# Altium schematic sheet 09_MRAM_RTC_WDT.SchDoc
size 420 x 297 mm; SheetNumber: 17; SheetTotal: 24
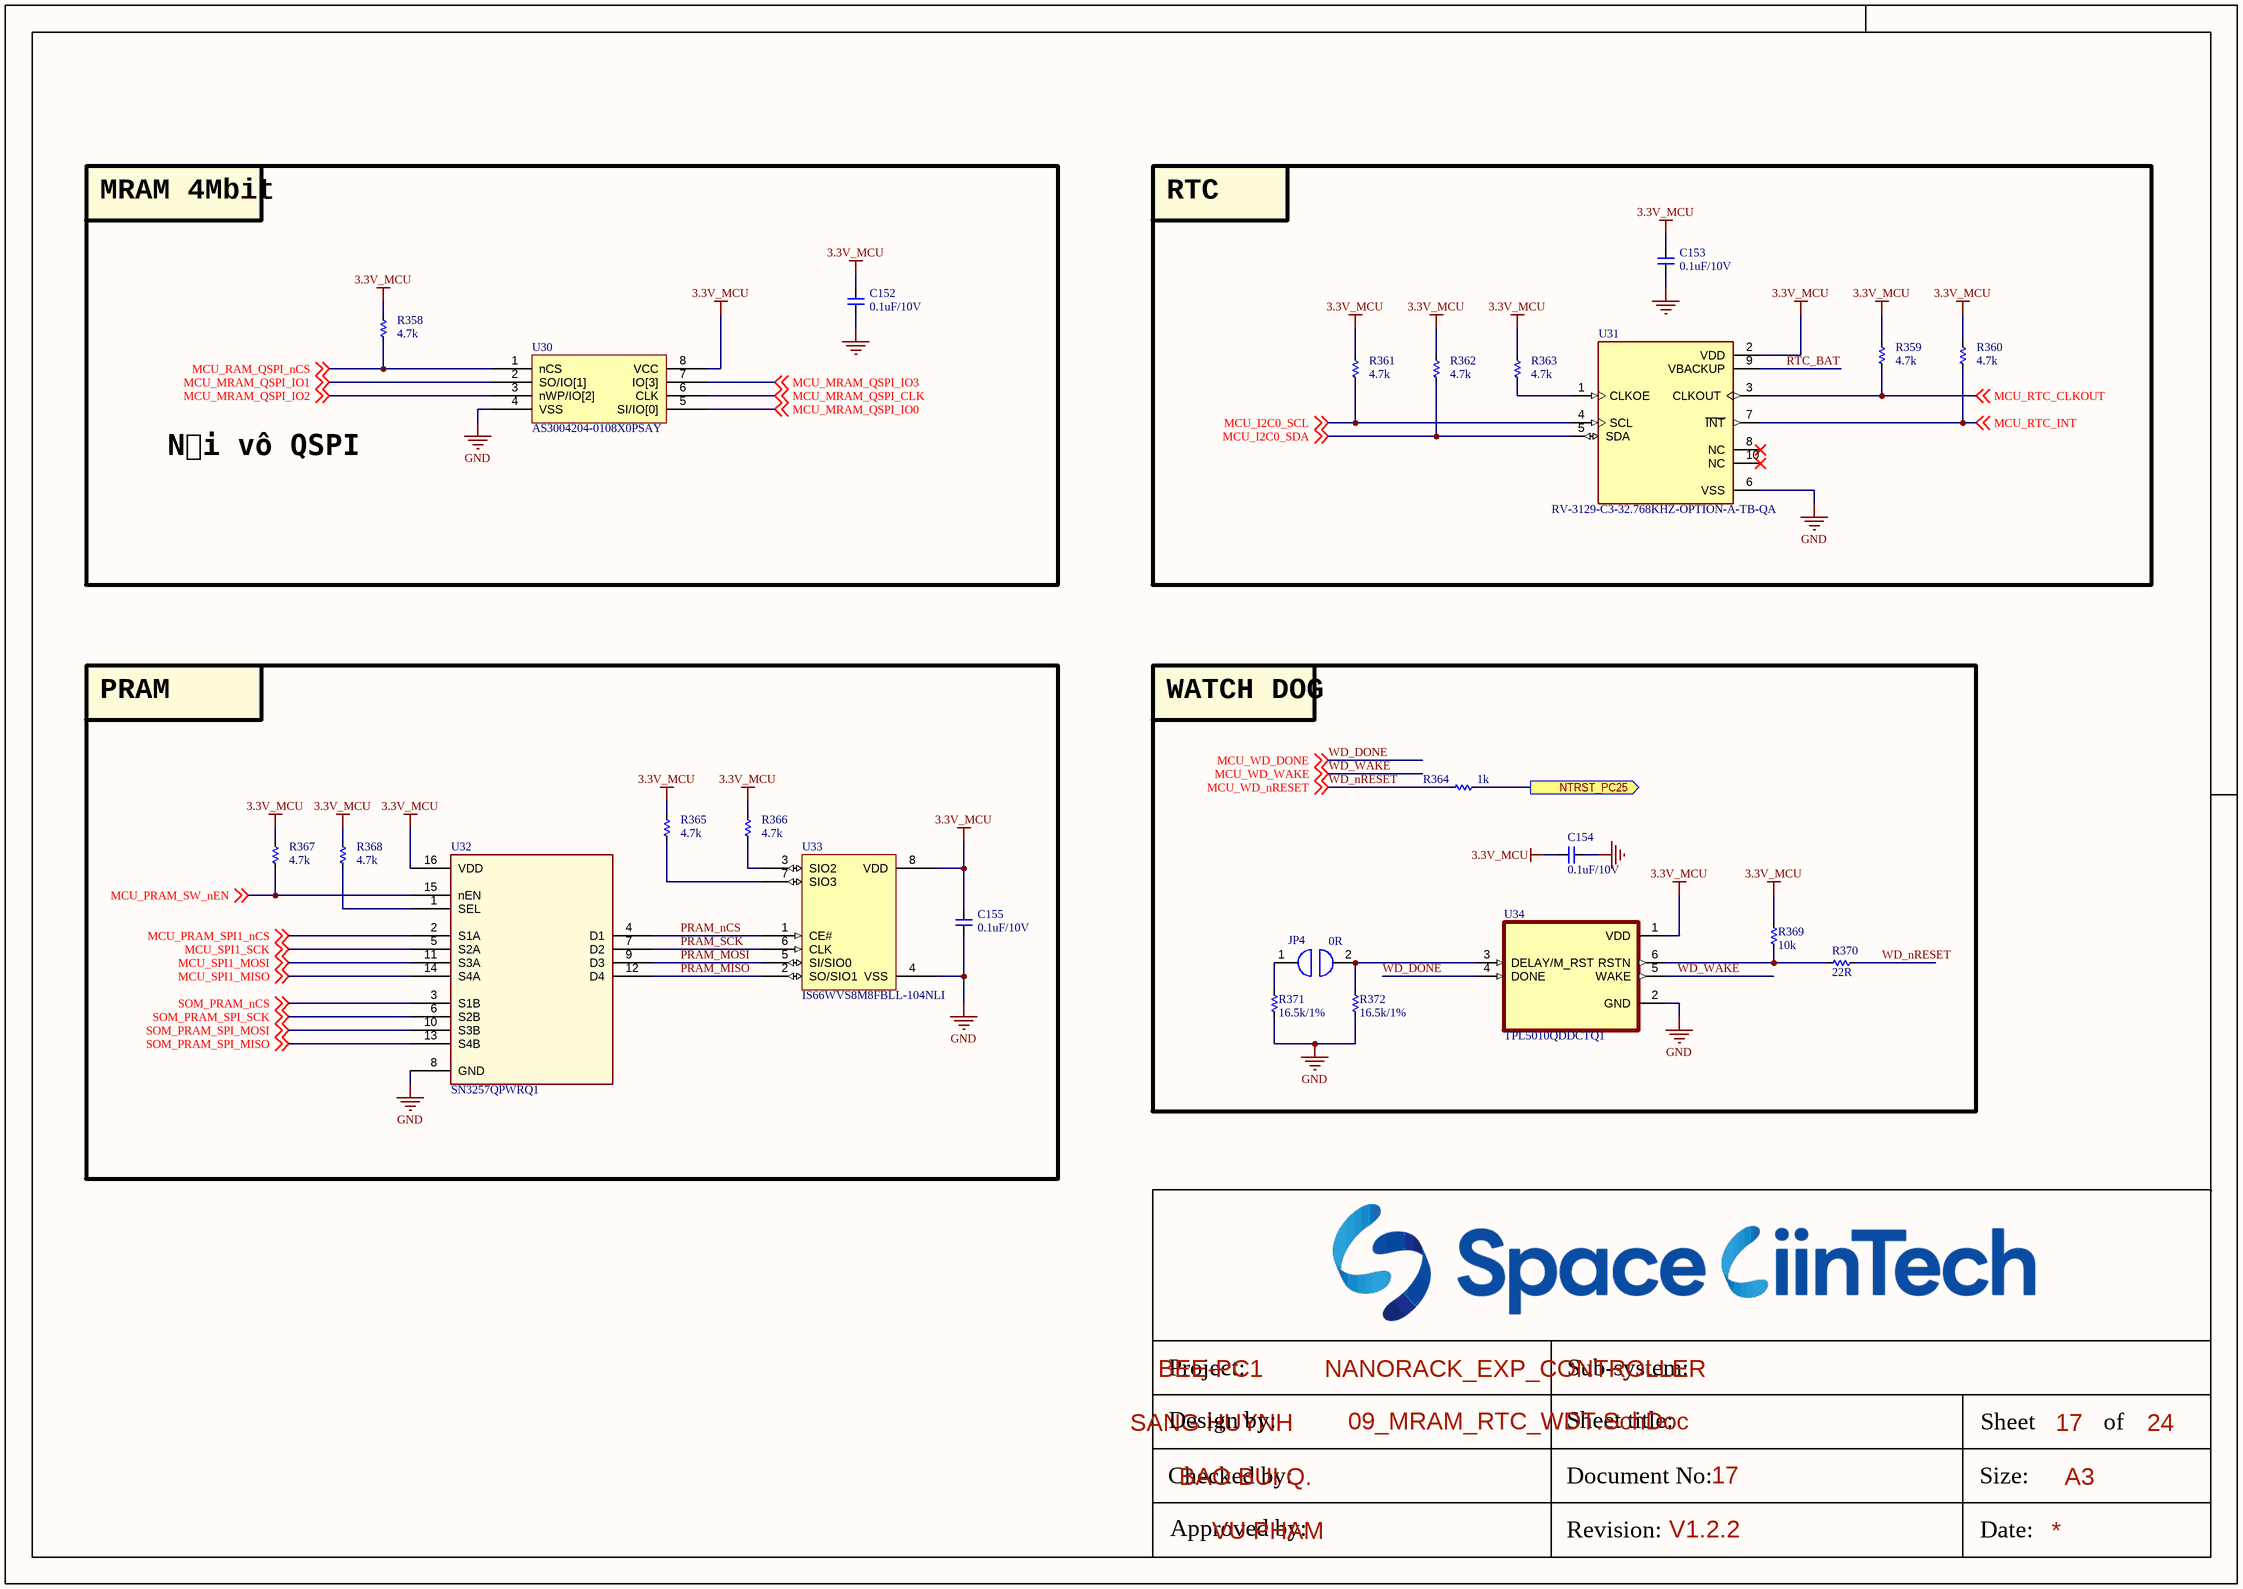
[diagram p0: 09_MRAM_RTC_WDT.SchDoc]

## Parts
C152  0.1uF/10V  [CAP_C_1005X60]
C153  0.1uF/10V  [CAP_C_1005X60]
C154  0.1uF/10V  [CAP_C_1005X60]
C155  0.1uF/10V  [CAP_C_1005X60]
JP4  0R  [RES_C_1608X60]
R358  4.7k  [RES_C_1005X40]
R359  4.7k  [RES_C_1005X40]
R360  4.7k  [RES_C_1005X40]
R361  4.7k  [RES_C_1005X40]
R362  4.7k  [RES_C_1005X40]
R363  4.7k  [RES_C_1005X40]
R364  1k  [RES_C_1005X40]
R365  4.7k  [RES_C_1005X40]
R366  4.7k  [RES_C_1005X40]
R367  4.7k  [RES_C_1005X40]
R368  4.7k  [RES_C_1005X40]
R369  10k  [RES_C_1005X40]
R370  22R  [RES_C_1005X40]
R371  16.5k/1%  [RES_C_1005X40]
R372  16.5k/1%  [RES_C_1005X40]
U30  AS3004204-0108X0PSAY  [SOIC127P790X216-8]
U31  RV-3129-C3-32.768KHZ-OPTION-A-TB-QA  [IC_RV-3129-C3_32.768KHZ_OPTION_A_TB_QA]
U32  SN3257QPWRQ1  [SOIC_PRQ1_TEX]
U33  IS66WVS8M8FBLL-104NLI  [SOIC8_150MIL_N_ISI]
U34  TPL5010QDDCTQ1  [SOT95P280X145-6N]

## Blocks framed on the sheet
RTC: C153 R359-R363 U31
PRAM: C155 R365-R368 U32 U33
WATCH DOG: C154 JP4 R364 R369-R372 U34

## Ports
NTRST_PC25 (out)

## Nets
3.3V_MCU: C152.2 C153.2 C154.2 C155.1 R358.2 R359.2 R360.2 R361.2 R362.2 R363.1 R365.2 R366.2 R367.2 R368.2 R369.2 U30.8(VCC) U31.2(VDD) U32.16(VDD) U33.8(VDD) U34.1(VDD)
GND: C152.1 C153.1 C154.1 C155.2 R371.1 R372.1 U30.4(VSS) U31.6(VSS) U32.8(GND) U33.4(VSS) U34.2(GND)
MCU_I2C0_SCL: R361.1 U31.4(SCL) ; off-sheet MCU_I2C0_SCL
MCU_I2C0_SDA: R362.1 U31.5(SDA) ; off-sheet MCU_I2C0_SDA
MCU_MRAM_QSPI_CLK: U30.6(CLK) ; off-sheet MCU_MRAM_QSPI_CLK
MCU_MRAM_QSPI_IO0: U30.5(SI/IO[0]) ; off-sheet MCU_MRAM_QSPI_IO0
MCU_MRAM_QSPI_IO1: U30.2(SO/IO[1]) ; off-sheet MCU_MRAM_QSPI_IO1
MCU_MRAM_QSPI_IO2: U30.3(nWP/IO[2]) ; off-sheet MCU_MRAM_QSPI_IO2
MCU_MRAM_QSPI_IO3: U30.7(IO[3]) ; off-sheet MCU_MRAM_QSPI_IO3
MCU_PRAM_SPI1_nCS: U32.2(S1A) ; off-sheet MCU_PRAM_SPI1_nCS
MCU_PRAM_SW_nEN: R367.1 U32.15(nEN) ; off-sheet MCU_PRAM_SW_nEN
MCU_RAM_QSPI_nCS: R358.1 U30.1(nCS) ; off-sheet MCU_RAM_QSPI_nCS
MCU_RTC_CLKOUT: R359.1 U31.3(CLKOUT) ; off-sheet MCU_RTC_CLKOUT
MCU_RTC_INT: R360.1 U31.7(~{INT}) ; off-sheet MCU_RTC_INT
MCU_SPI1_MISO: U32.14(S4A) ; off-sheet MCU_SPI1_MISO
MCU_SPI1_MOSI: U32.11(S3A) ; off-sheet MCU_SPI1_MOSI
MCU_SPI1_SCK: U32.5(S2A) ; off-sheet MCU_SPI1_SCK
NTRST_PC25: R364.1 ; port NTRST_PC25
PRAM_MISO: U32.12(D4) U33.2(SO/SIO1)
PRAM_MOSI: U32.9(D3) U33.5(SI/SIO0)
PRAM_nCS: U32.4(D1) U33.1(CE#)
PRAM_SCK: U32.7(D2) U33.6(CLK)
RTC_BAT: U31.9(VBACKUP)
SOM_PRAM_nCS: U32.3(S1B) ; off-sheet SOM_PRAM_nCS
SOM_PRAM_SPI_MISO: U32.13(S4B) ; off-sheet SOM_PRAM_SPI_MISO
SOM_PRAM_SPI_MOSI: U32.10(S3B) ; off-sheet SOM_PRAM_SPI_MOSI
SOM_PRAM_SPI_SCK: U32.6(S2B) ; off-sheet SOM_PRAM_SPI_SCK
WD_DONE: U34.4(DONE) ; off-sheet MCU_WD_DONE  [also labelled MCU_WD_DONE]
WD_nRESET: R364.2 R370.1 ; off-sheet MCU_WD_nRESET  [also labelled MCU_WD_nRESET]
WD_WAKE: U34.5(WAKE) ; off-sheet MCU_WD_WAKE  [also labelled MCU_WD_WAKE]
NetJP4_1: JP4.1 R371.2
NetJP4_2: JP4.2 R372.2 U34.3(DELAY/M_RST)
NetR363_2: R363.2 U31.1(CLKOE)
NetR365_1: R365.1 U33.7(SIO3)
NetR366_1: R366.1 U33.3(SIO2)
NetR368_1: R368.1 U32.1(SEL)
NetR369_1: R369.1 R370.2 U34.6(RSTN)

Not connected (* = marked no-connect by the designer): U31 8(NC)* 10(NC)*

## Notes on the sheet
- MRAM 4Mbit
- Nối vô QSPI
- Project:
- BEE-PC1
- Sub-system:
- NANORACK_EXP_CONTROLLER
- Design by:
- SANG HUYNH
- BAO BUI Q.
- Sheet title:
- Sheet
- A3
- of
- Checked by:
- Approved by:
- VU PHAM
- Revision:
- Document No:
- V1.2.2
- Size:
- Date:

## Library data of the parts
C152-C155 = _CAP_C_2: CAP CHIP
JP4 = JUMPER
R358-R372 = _RES_B_2: RES
U30 = IC_RAM_AS3004204-0108X0PSAY
U31 = RV-3129-C3_32.768KHZ_OPTION_A_TB_QA: Real-Time Clock Module, Temperature compensated, in 2.5 x 3.7 mm package; MF: Micro Crystal; MP: RV-3129-C3 32.768KHZ OPTION A TB QA; SnapEDA_Link: https://www.snapeda.com/parts/RV-3129-C3%2032.768KHZ%20OPTION%20A%20TB%20QA/Micro+Crystal/view-part/?ref=snap; Package: QFN-10 Micro Crystal; Value: *; Check_prices: https://www.snapeda.com/parts/RV-3129-C3%2032.768KHZ%20OPTION%20A%20TB%20QA/Micro+Crystal/view-part/?ref=eda
U32 = IC_SW_SPI_SN3257QPWRQ1: Automotive 5-V, 2:1 (SPDT), 4-channel switch with 1.8-V logic and powered-off protection 16-TSSOP -40 to 125; Manufacturer_Name: Texas Instruments; Copyright: Copyright (C) 2025 Ultra Librarian. All rights reserved.; Manufacturer_Part_Number: SN3257QPWRQ1; Datasheet: https://www.ti.com/lit/gpn/sn3257-q1; RefDes: RefDes; Type: Type
U33 = IS66WVS4M8BLL-104NLI: No Description Available; Manufacturer_Name: ISSI; Type: Memory; Copyright: Copyright (C) 2025 Ultra Librarian. All rights reserved.; Manufacturer_Part_Number: IS66WVS4M8BLL-104NLI; RefDes: RefDes
U34 = TPL5010QDDCTQ1: Package: None; Price: None; Value: *; MP: TPL5010QDDCTQ1; Availability: Unavailable